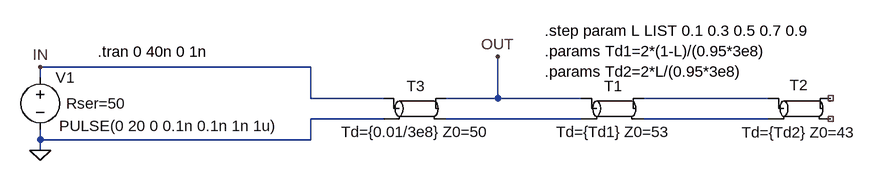
[diagram p0: schematic TDALevelSensor.asc]
TDALevelSensor.asc, the LTspice schematic file:
Version 4
SHEET 1 1272 680
WIRE -448 176 -864 176
WIRE -864 192 -864 176
WIRE -448 224 -448 176
WIRE -336 224 -448 224
WIRE -160 224 -160 160
WIRE -160 224 -240 224
WIRE -32 224 -160 224
WIRE 256 224 64 224
WIRE -336 256 -448 256
WIRE -32 256 -240 256
WIRE 256 256 64 256
WIRE -864 288 -864 272
WIRE -448 288 -448 256
WIRE -448 288 -864 288
WIRE -864 304 -864 288
FLAG -864 304 0
FLAG -864 176 IN
FLAG -160 160 OUT
SYMBOL tline 16 240 R0
WINDOW 0 2 -19 Bottom 2
WINDOW 3 3 20 Top 2
SYMATTR InstName T1
SYMATTR Value Td={Td1} Z0=53
SYMBOL tline 304 240 R0
WINDOW 0 -1 -21 Bottom 2
WINDOW 3 0 21 Top 2
SYMATTR InstName T2
SYMATTR Value Td={Td2} Z0=43
SYMBOL voltage -864 176 R0
WINDOW 123 0 0 Left 2
WINDOW 39 40 56 Left 2
WINDOW 3 29 91 Left 2
SYMATTR SpiceLine Rser=50
SYMATTR InstName V1
SYMATTR Value PULSE(0 20 0 0.1n 0.1n 1n 1u)
SYMBOL tline -288 240 R0
WINDOW 0 2 -19 Bottom 2
WINDOW 3 2 20 Top 2
SYMATTR InstName T3
SYMATTR Value Td={0.01/3e8} Z0=50
TEXT -88 120 Left 2 !.step param L LIST 0.1 0.3 0.5 0.7 0.9\n.params Td1=2*(1-L)/(0.95*3e8)\n.params Td2=2*L/(0.95*3e8)
TEXT -776 152 Left 2 !.tran 0 40n 0 1n

The netlist it stands for:
* TDALevelSensor.asc
T1 OUT N002 N001 N003 Td={Td1} Z0=53
T2 N001 N003 NC_01 NC_02 Td={Td2} Z0=43
V1 IN 0 PULSE(0 20 0 0.1n 0.1n 1n 1u) Rser=50
T3 IN 0 OUT N002 Td={0.01/3e8} Z0=50
.step param L LIST 0.1 0.3 0.5 0.7 0.9
.params Td1=2*(1-L)/(0.95*3e8)
.params Td2=2*L/(0.95*3e8)
.tran 0 40n 0 1n
.backanno
.end